# EAGLE design VauDUOv1_2 (EAGLE 6.5.0)
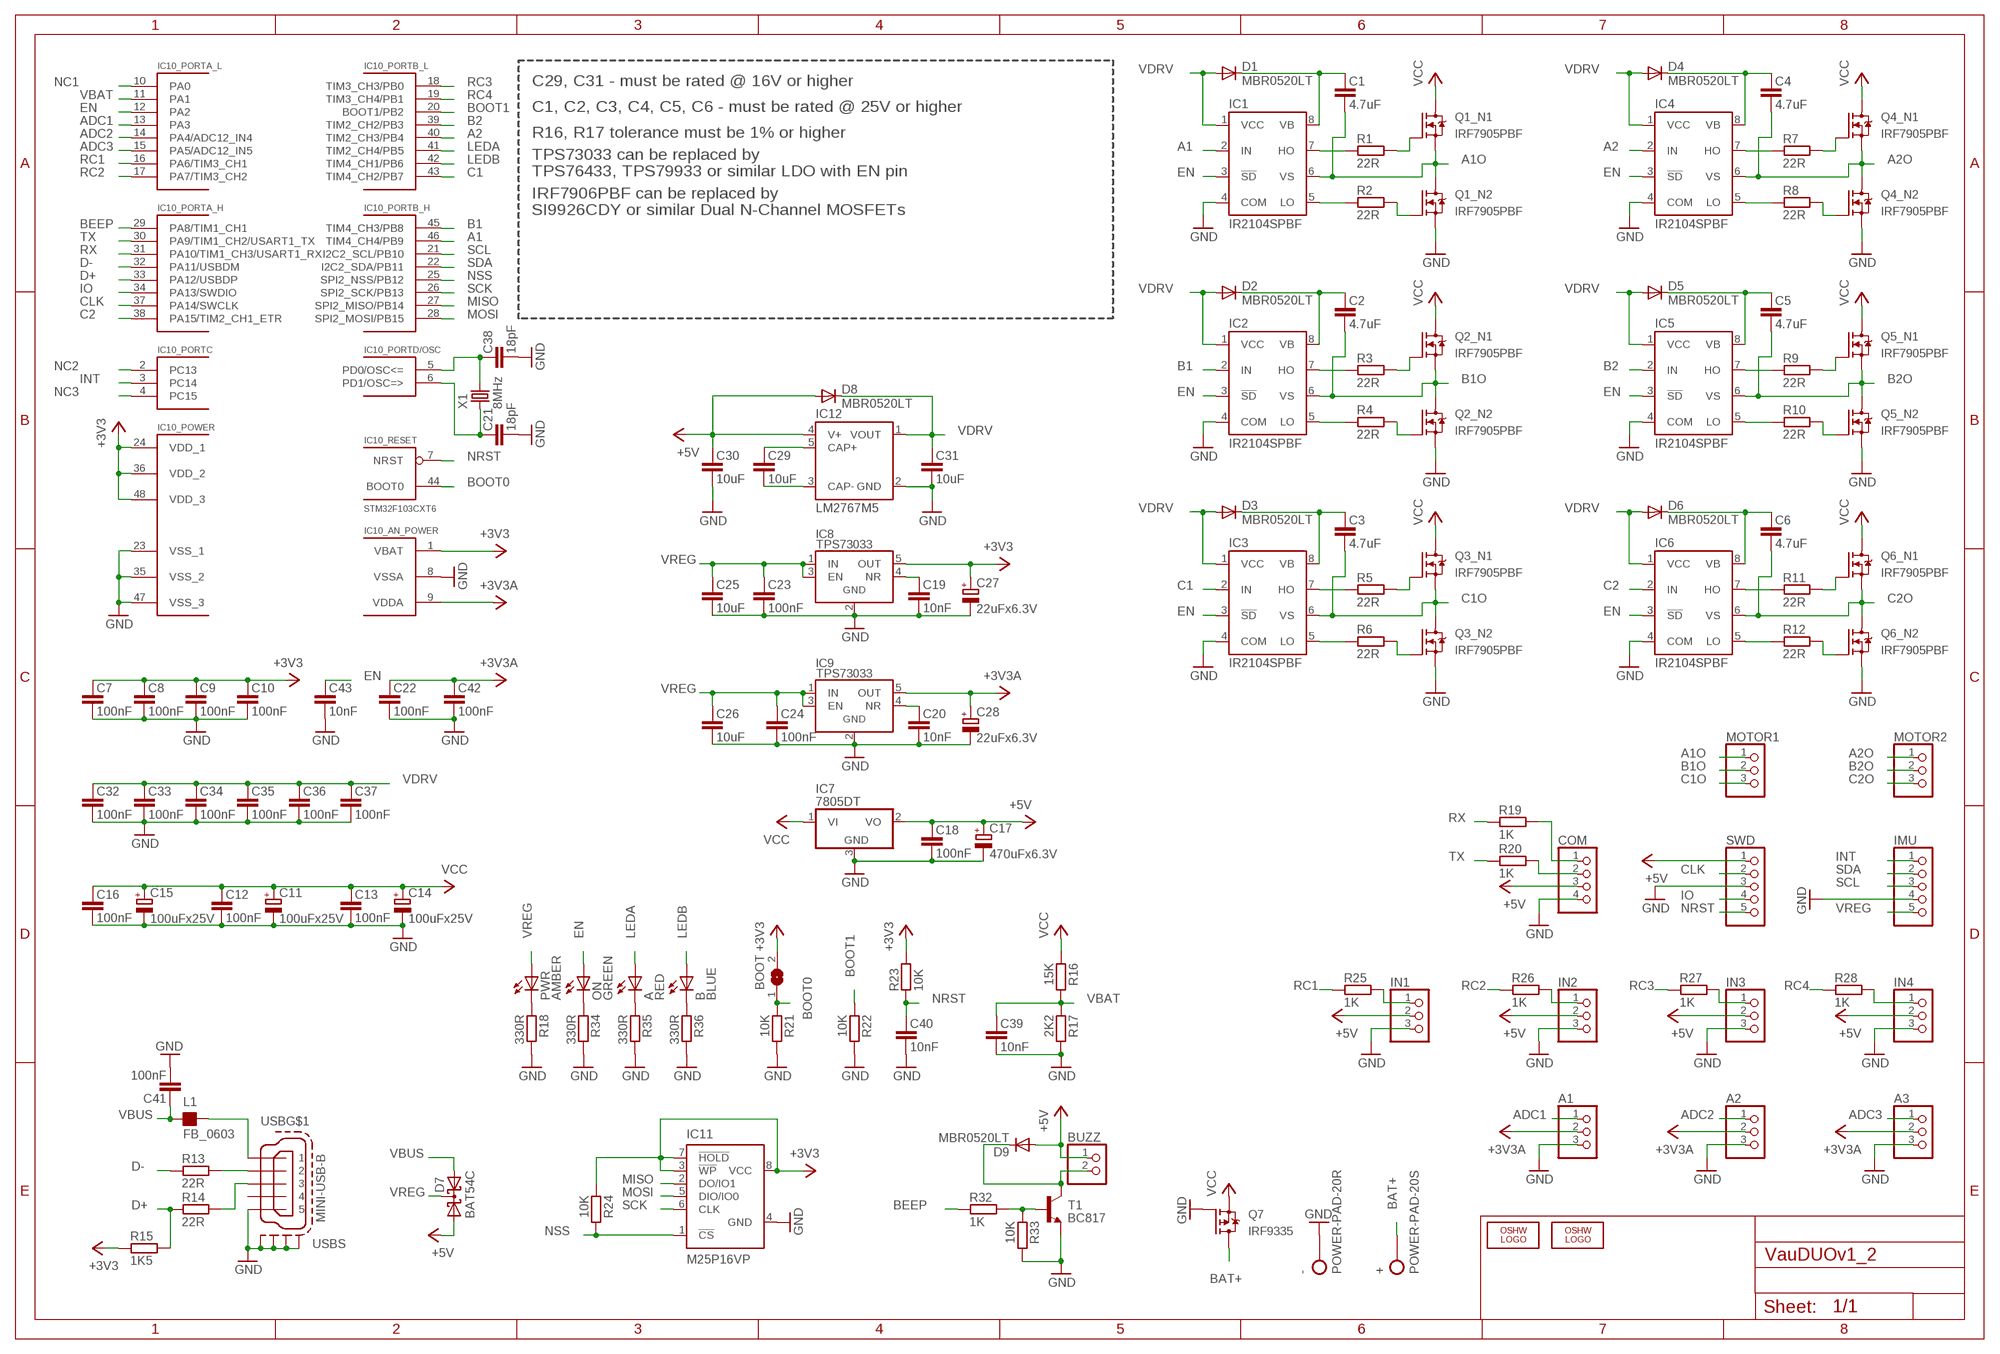
[diagram p0: schematic, sheet 1]

## Parts
+  POWER-PAD-20S  [PAD20S]
-  POWER-PAD-20R  [PAD20R]
A  RED  LEDCHIPLED_0805  [CHIPLED_0805]
A1  PINHD-1X3  [1X03]
A2  PINHD-1X3  [1X03]
A3  PINHD-1X3  [1X03]
B  BLUE  LEDCHIPLED_0805  [CHIPLED_0805]
BOOT  SJ  [SJ]
BUZZ  PINHD-1X2  [1X02]
C1  4.7uF  C_EU_C0805  [C0805]
C2  4.7uF  C_EU_C0805  [C0805]
C3  4.7uF  C_EU_C0805  [C0805]
C4  4.7uF  C_EU_C0805  [C0805]
C5  4.7uF  C_EU_C0805  [C0805]
C6  4.7uF  C_EU_C0805  [C0805]
C7  100nF  C_EU_C0603G  [C0603G]
C8  100nF  C_EU_C0603G  [C0603G]
C9  100nF  C_EU_C0603G  [C0603G]
C10  100nF  C_EU_C0603G  [C0603G]
C11  100uFx25V  CPOL-EUE2.5-7  [E2,5-7]
C12  100nF  C_EU_C0603G  [C0603G]
C13  100nF  C_EU_C0603G  [C0603G]
C14  100uFx25V  CPOL-EUE2.5-7  [E2,5-7]
C15  100uFx25V  CPOL-EUSMCD  [SMC_D]
C16  100nF  C_EU_C0603G  [C0603G]
C17  470uFx6.3V  CPOL-EUSMCD  [SMC_D]
C18  100nF  C_EU_C0603G  [C0603G]
C19  10nF  C_EU_C0603G  [C0603G]
C20  10nF  C_EU_C0603G  [C0603G]
C21  18pF  C_EU_C0603G  [C0603G]
C22  100nF  C_EU_C0603G  [C0603G]
C23  100nF  C_EU_C0603G  [C0603G]
C24  100nF  C_EU_C0603G  [C0603G]
C25  10uF  C_EU_C0805G  [C0805G]
C26  10uF  C_EU_C0805G  [C0805G]
C27  22uFx6.3V  CPOL-EUSMCA  [SMC_A]
C28  22uFx6.3V  CPOL-EUSMCA  [SMC_A]
C29  10uF  C_EU_C0805  [C0805]
C30  10uF  C_EU_C0805G  [C0805G]
C31  10uF  C_EU_C0805G  [C0805G]
C32  100nF  C_EU_C0603G  [C0603G]
C33  100nF  C_EU_C0603G  [C0603G]
C34  100nF  C_EU_C0603G  [C0603G]
C35  100nF  C_EU_C0603G  [C0603G]
C36  100nF  C_EU_C0603G  [C0603G]
C37  100nF  C_EU_C0603G  [C0603G]
C38  18pF  C_EU_C0603G  [C0603G]
C39  10nF  C_EU_C0603G  [C0603G]
C40  10nF  C_EU_C0603G  [C0603G]
C41  100nF  C_EU_C0603G  [C0603G]
C42  100nF  C_EU_C0603G  [C0603G]
C43  10nF  C_EU_C0603G  [C0603G]
COM  PINHD-1X4  [1X04]
D1  MBR0520LT  [SOD123]
D2  MBR0520LT  [SOD123]
D3  MBR0520LT  [SOD123]
D4  MBR0520LT  [SOD123]
D5  MBR0520LT  [SOD123]
D6  MBR0520LT  [SOD123]
D7  BAT54C  [SOT23]
D8  MBR0520LT  [SOD123]
D9  MBR0520LT  [SOD123]
IC1  IR2104SPBF  [SOIC-8]
IC2  IR2104SPBF  [SOIC-8]
IC3  IR2104SPBF  [SOIC-8]
IC4  IR2104SPBF  [SOIC-8]
IC5  IR2104SPBF  [SOIC-8]
IC6  IR2104SPBF  [SOIC-8]
IC7  7805DT  [TO252]
IC8  TPS73033  TPS769XX  [SOT23-5]
IC9  TPS73033  TPS769XX  [SOT23-5]
IC10  STM32F103CXT6  [LQFP48]
IC11  M25P16VP  W25X40BVSNIG  [SOIC-8]
IC12  LM2767M5  [SOT23-5]
IMU  PINHD-1X5  [1X05]
IN1  PINHD-1X3  [1X03]
IN2  PINHD-1X3  [1X03]
IN3  PINHD-1X3  [1X03]
IN4  PINHD-1X3  [1X03]
L1  FB_0603  [L0603]
LOGO1  OSHW_LOGO_10MILX0350-NT  [OSHW_10X350_NOTEXT]
LOGO2  OSHW_LOGO_FILLX0150-NT  [OSHW_FILLX150_NOTEXT]
MOTOR1  PINHD-1X3MOT  [1X03M]
MOTOR2  PINHD-1X3MOT  [1X03M]
ON  GREEN  LEDCHIPLED_0805  [CHIPLED_0805]
PWR  AMBER  LEDCHIPLED_0805  [CHIPLED_0805]
Q1  IRF7905PBF  [SOIC-8]
Q2  IRF7905PBF  [SOIC-8]
Q3  IRF7905PBF  [SOIC-8]
Q4  IRF7905PBF  [SOIC-8]
Q5  IRF7905PBF  [SOIC-8]
Q6  IRF7905PBF  [SOIC-8]
Q7  IRF9335  [SOIC-8]
R1  22R  R_EU_R0603  [R0603]
R2  22R  R_EU_R0603  [R0603]
R3  22R  R_EU_R0603  [R0603]
R4  22R  R_EU_R0603  [R0603]
R5  22R  R_EU_R0603  [R0603]
R6  22R  R_EU_R0603  [R0603]
R7  22R  R_EU_R0603  [R0603]
R8  22R  R_EU_R0603  [R0603]
R9  22R  R_EU_R0603  [R0603]
R10  22R  R_EU_R0603  [R0603]
R11  22R  R_EU_R0603  [R0603]
R12  22R  R_EU_R0603  [R0603]
R13  22R  R_EU_R0603  [R0603]
R14  22R  R_EU_R0603  [R0603]
R15  1K5  R_EU_R0603  [R0603]
R16  15K  R_EU_R0603  [R0603]
R17  2K2  R_EU_R0603G  [R0603G]
R18  330R  R_EU_R0603G  [R0603G]
R19  1K  R_EU_R0603  [R0603]
R20  1K  R_EU_R0603  [R0603]
R21  10K  R_EU_R0603G  [R0603G]
R22  10K  R_EU_R0603G  [R0603G]
R23  10K  R_EU_R0603  [R0603]
R24  10K  R_EU_R0603  [R0603]
R25  1K  R_EU_R0603  [R0603]
R26  1K  R_EU_R0603  [R0603]
R27  1K  R_EU_R0603  [R0603]
R28  1K  R_EU_R0603  [R0603]
R32  1K  R_EU_R0603  [R0603]
R33  10K  R_EU_R0603G  [R0603G]
R34  330R  R_EU_R0603G  [R0603G]
R35  330R  R_EU_R0603G  [R0603G]
R36  330R  R_EU_R0603G  [R0603G]
SWD  PINHD-1X5  [1X05]
T1  BC817  BC817-16LT1SMD  [SOT23-BEC]
USB  MINI-USB-B  MINI-USB-SCHIELD-32005-201  [32005-201]
X1  8MHz  CRYSTALHC49S  [HC49/S]

## Nets
+3V3: BOOT.2 C7.1 C8.1 C9.1 C10.1 C27.+ IC8.5(OUT) IC10.1(_AN_POWER:VBAT) IC10.24(_POWER:VDD_1) IC10.36(_POWER:VDD_2) IC10.48(_POWER:VDD_3) IC11.3(!WP) IC11.7(!HOLD) IC11.8(VCC) R15.1 R23.2 R24.1
+3V3A: A1.2 A2.2 A3.2 C22.1 C28.+ C42.1 IC9.5(OUT) IC10.9(_AN_POWER:VDDA)
+5V: BUZZ.1 C17.+ C18.1 C30.1 COM.3 D7.1(A1) D8.A D9.A IC7.2(VO) IC12.4(V+) IN1.2 IN2.2 IN3.2 IN4.2 SWD.1
A1: IC1.2(IN) IC10.46(_PORTB_H:TIM4_CH4/PB9)
A1O [power]: C1.2 IC1.6(VS) MOTOR1.1 Q1.3(_N1:N-S) Q1.7(_N2:N-D) Q1.8(_N2:N-D)
A2: IC4.2(IN) IC10.40(_PORTB_L:TIM2_CH3/PB4)
A2O [power]: C4.2 IC4.6(VS) MOTOR2.1 Q4.3(_N1:N-S) Q4.7(_N2:N-D) Q4.8(_N2:N-D)
ADC1: A1.1 IC10.13(_PORTA_L:PA3)
ADC2: A2.1 IC10.14(_PORTA_L:PA4/ADC12_IN4)
ADC3: A3.1 IC10.15(_PORTA_L:PA5/ADC12_IN5)
B1: IC2.2(IN) IC10.45(_PORTB_H:TIM4_CH3/PB8)
B1O [power]: C2.2 IC2.6(VS) MOTOR1.2 Q2.3(_N1:N-S) Q2.7(_N2:N-D) Q2.8(_N2:N-D)
B2: IC5.2(IN) IC10.39(_PORTB_L:TIM2_CH2/PB3)
B2O [power]: C5.2 IC5.6(VS) MOTOR2.2 Q5.3(_N1:N-S) Q5.7(_N2:N-D) Q5.8(_N2:N-D)
BAT+ [power]: +.P$1 Q7.5(P-D) Q7.6(P-D) Q7.7(P-D) Q7.8(P-D)
BEEP: IC10.29(_PORTA_H:PA8/TIM1_CH1) R32.1
BOOT0: BOOT.1 IC10.44(_RESET:BOOT0) R21.1
BOOT1: IC10.20(_PORTB_L:BOOT1/PB2) R22.1
C1: IC3.2(IN) IC10.43(_PORTB_L:TIM4_CH2/PB7)
C1O [power]: C3.2 IC3.6(VS) MOTOR1.3 Q3.3(_N1:N-S) Q3.7(_N2:N-D) Q3.8(_N2:N-D)
C2: IC6.2(IN) IC10.38(_PORTA_H:PA15/TIM2_CH1_ETR)
C2O [power]: C6.2 IC6.6(VS) MOTOR2.3 Q6.3(_N1:N-S) Q6.7(_N2:N-D) Q6.8(_N2:N-D)
CLK: IC10.37(_PORTA_H:PA14/SWCLK) SWD.2
D+: IC10.33(_PORTA_H:PA12/USBDP) R14.1 R15.2
D-: IC10.32(_PORTA_H:PA11/USBDM) R13.1
EN: C43.1 IC1.3(!SD) IC2.3(!SD) IC3.3(!SD) IC4.3(!SD) IC5.3(!SD) IC6.3(!SD) IC10.12(_PORTA_L:PA2) ON.A
GND: -.P$1 A1.3 A2.3 A3.3 C7.2 C8.2 C9.2 C10.2 C11.- C12.2 C13.2 C14.- C15.- C16.2 C17.- C18.2 C19.2 C20.2 C21.2 C22.2 C23.2 C24.2 C25.2 C26.2 C27.- C28.- C30.2 C31.2 C32.2 C33.2 C34.2 C35.2 C36.2 C37.2 C38.2 C39.2 C40.2 C41.2 C42.2 C43.2 COM.4 IC1.4(COM) IC2.4(COM) IC3.4(COM) IC4.4(COM) IC5.4(COM) IC6.4(COM) IC7.3(GND) IC8.2(GND) IC9.2(GND) IC10.8(_AN_POWER:VSSA) IC10.23(_POWER:VSS_1) IC10.35(_POWER:VSS_2) IC10.47(_POWER:VSS_3) IC11.4(GND) IC12.2(GND) IMU.4 IN1.3 IN2.3 IN3.3 IN4.3 Q1.1(_N2:N-S) Q2.1(_N2:N-S) Q3.1(_N2:N-S) Q4.1(_N2:N-S) Q5.1(_N2:N-S) Q6.1(_N2:N-S) Q7.4(P-G) R17.2 R18.2 R21.2 R22.2 R33.2 R34.2 R35.2 R36.2 SWD.3 T1.E USB.5 USB.M1(S:S1) USB.M2(S:S2) USB.M3(S:S3) USB.M4(S:S4)
INT: IC10.3(_PORTC:PC14) IMU.1
IO: IC10.34(_PORTA_H:PA13/SWDIO) SWD.4
LEDA: A.A IC10.41(_PORTB_L:TIM2_CH4/PB5)
LEDB: B.A IC10.42(_PORTB_L:TIM4_CH1/PB6)
MISO: IC10.27(_PORTB_H:SPI2_MISO/PB14) IC11.2(DO/IO1)
MOSI: IC10.28(_PORTB_H:SPI2_MOSI/PB15) IC11.5(DIO/IO0)
N$1: IC2.7(HO) R3.1
N$2: Q1.2(_N2:N-G) R2.2
N$3: Q1.4(_N1:N-G) R1.2
N$4: IC2.5(LO) R4.1
N$5 [power]: C2.1 D2.C IC2.8(VB)
N$6 [power]: C1.1 D1.C IC1.8(VB)
N$7: Q2.2(_N2:N-G) R4.2
N$8: Q2.4(_N1:N-G) R3.2
N$9: IC3.7(HO) R5.1
N$10: IC3.5(LO) R6.1
N$11 [power]: C3.1 D3.C IC3.8(VB)
N$12: Q3.2(_N2:N-G) R6.2
N$13: Q3.4(_N1:N-G) R5.2
N$14: IC4.7(HO) R7.1
N$15: IC4.5(LO) R8.1
N$16 [power]: C4.1 D4.C IC4.8(VB)
N$17: Q4.2(_N2:N-G) R8.2
N$18: Q4.4(_N1:N-G) R7.2
N$19: IC1.7(HO) R1.1
N$20: IC1.5(LO) R2.1
N$21: IC5.7(HO) R9.1
N$22: IC5.5(LO) R10.1
N$23 [power]: C5.1 D5.C IC5.8(VB)
N$24: Q5.2(_N2:N-G) R10.2
N$25: Q5.4(_N1:N-G) R9.2
N$26: IC6.7(HO) R11.1
N$27: IC6.5(LO) R12.1
N$28 [power]: C6.1 D6.C IC6.8(VB)
N$29: Q6.2(_N2:N-G) R12.2
N$30: Q6.4(_N1:N-G) R11.2
N$31: R13.2 USB.2
N$32: C29.1 IC12.5(CAP+)
N$33: R14.2 USB.3
N$34: C19.1 IC8.4(NR)
N$35: IN1.1 R25.2
N$36: C20.1 IC9.4(NR)
N$37: L1.2 USB.1
N$38: C21.1 IC10.6(_PORTD/OSC:PD1/OSC=>) X1.1
N$39: C38.1 IC10.5(_PORTD/OSC:PD0/OSC<=) X1.2
N$40: C29.2 IC12.3(CAP-)
N$41: PWR.C R18.1
N$42: COM.1 R19.2
N$43: COM.2 R20.2
N$44: IN2.1 R26.2
N$45: IN3.1 R27.2
N$46: IN4.1 R28.2
N$49: BUZZ.2 D9.C T1.C
N$50: R32.2 R33.1 T1.B
N$51: ON.C R34.1
N$55: A.C R35.1
N$56: B.C R36.1
NC1: IC10.10(_PORTA_L:PA0)
NC2: IC10.2(_PORTC:PC13)
NC3: IC10.4(_PORTC:PC15)
NRST: C40.1 IC10.7(_RESET:NRST) R23.1 SWD.5
NSS: IC10.25(_PORTB_H:SPI2_NSS/PB12) IC11.1(!CS) R24.2
RC1: IC10.16(_PORTA_L:PA6/TIM3_CH1) R25.1
RC2: IC10.17(_PORTA_L:PA7/TIM3_CH2) R26.1
RC3: IC10.18(_PORTB_L:TIM3_CH3/PB0) R27.1
RC4: IC10.19(_PORTB_L:TIM3_CH4/PB1) R28.1
RX: IC10.31(_PORTA_H:PA10/TIM1_CH3/USART1_RX) R19.1
SCK: IC10.26(_PORTB_H:SPI2_SCK/PB13) IC11.6(CLK)
SCL: IC10.21(_PORTB_H:I2C2_SCL/PB10) IMU.3
SDA: IC10.22(_PORTB_H:I2C2_SDA/PB11) IMU.2
TX: IC10.30(_PORTA_H:PA9/TIM1_CH2/USART1_TX) R20.1
VBAT: C39.1 IC10.11(_PORTA_L:PA1) R16.2 R17.1
VBUS: C41.1 D7.2(A2) L1.1
VCC [power]: C11.+ C12.1 C13.1 C14.+ C15.+ C16.1 IC7.1(VI) Q1.5(_N1:N-D) Q1.6(_N1:N-D) Q2.5(_N1:N-D) Q2.6(_N1:N-D) Q3.5(_N1:N-D) Q3.6(_N1:N-D) Q4.5(_N1:N-D) Q4.6(_N1:N-D) Q5.5(_N1:N-D) Q5.6(_N1:N-D) Q6.5(_N1:N-D) Q6.6(_N1:N-D) Q7.1(P-S) Q7.2(P-S) Q7.3(P-S) R16.1
VDRV: C31.1 C32.1 C33.1 C34.1 C35.1 C36.1 C37.1 D1.A D2.A D3.A D4.A D5.A D6.A D8.C IC1.1(VCC) IC2.1(VCC) IC3.1(VCC) IC4.1(VCC) IC5.1(VCC) IC6.1(VCC) IC12.1(VOUT)
VREG: C23.1 C24.1 C25.1 C26.1 D7.3(CC) IC8.1(IN) IC8.3(EN) IC9.1(IN) IC9.3(EN) IMU.5 PWR.A
Unconnected: USB.4

## Notes on the sheet
- C29, C31 - must be rated @ 16V or higher
- C1, C2, C3, C4, C5, C6 - must be rated @ 25V or higher
- R16, R17 tolerance must be 1% or higher
- TPS73033 can be replaced by
  TPS76433, TPS79933 or similar LDO with EN pin
- IRF7906PBF can be replaced by
  SI9926CDY or similar Dual N-Channel MOSFETs

## Library data of the parts
+ - = svBGC:POWER-PAD
A B ON PWR = svBGC:LED
A1-A3 IN1-IN4 MOTOR1 MOTOR2 = svBGC:PINHD-1X3: PIN HEADER
BOOT = svBGC:SJ: SMD solder JUMPER
BUZZ = svBGC:PINHD-1X2: PIN HEADER
C1-C10 C12 C13 C16 C18-C26 C29-C43 = svBGC:C_EU_
C11 C14 C15 C17 C27 C28 = svBGC:CPOL-EU: POLARIZED CAPACITOR, European symbol
COM = svBGC:PINHD-1X4: PIN HEADER
D1-D6 D8 D9 = svBGC:MBR0520LT: SCHOTTKY BARRIER RECTIFIER Source: http://onsemi.com .. MBR0520LT1-D.pdf
D7 = svBGC:BAT54C: Schottky Diodes Source: Fairchild .. BAT54.pdf
IC1-IC6 = svBGC:IR2104: International Rectifier IR2104(S) & (PbF) HALF-BRIDGE DRIVER Product Summary VOFFSET 600V max. IO+/- 130 mA / 270 mA VOUT 10 - 20V ton/off (typ.) 680 & 150 ns Deadtime (typ.) 520 ns
IC7 = linear:78*: Positive VOLTAGE REGULATOR Source: http://cache.national.com/ds/LM/LM78L05.pdf http://www.fairchildsemi.com/ds/LM/LM7805.pdf
IC8 IC9 = svBGC:TPS769XX: Texas Instruments LDO Regulator
IC10 = svBGC:STM32F103CXT6
IC11 = svBGC:W25X: Winbond SPI Flash Memory
IC12 = svBGC:LM2767: Texas Instruments LM2767 Switched Capacitor Voltage Converter FEATURES Doubles Input Supply Voltage SOT-23 5-Pin Package 20Ω Typical Output Impedance 96% Typical Conversion Efficiency at 15mA
IMU SWD = svBGC:PINHD-1X5: PIN HEADER
L1 = svBGC:FB_: FERRITE BEAD
LOGO1 = ohw-logo:OSHW_LOGO_10MIL
LOGO2 = ohw-logo:OSHW_LOGO_FILL
Q1-Q6 = svBGC:IRF7905
Q7 = svBGC:IRF9335
R1-R28 R32-R36 = svBGC:R_EU_
T1 = svBGC:BC817*: NPN Transistor
USB = svBGC:MINI-USB-SCHIELD-: MINI USB-B Conector Source: www.cypressindustries.com; OC_FARNELL: unknown; OC_NEWARK: unknown
X1 = svBGC:CRYSTAL: CRYSTAL; OC_FARNELL: 1667008; OC_NEWARK: unknown

## Net classes
0 default: width 0.203 mm, clearance 0.203 mm
1 power: width 0.254 mm, clearance 0.305 mm

## Board
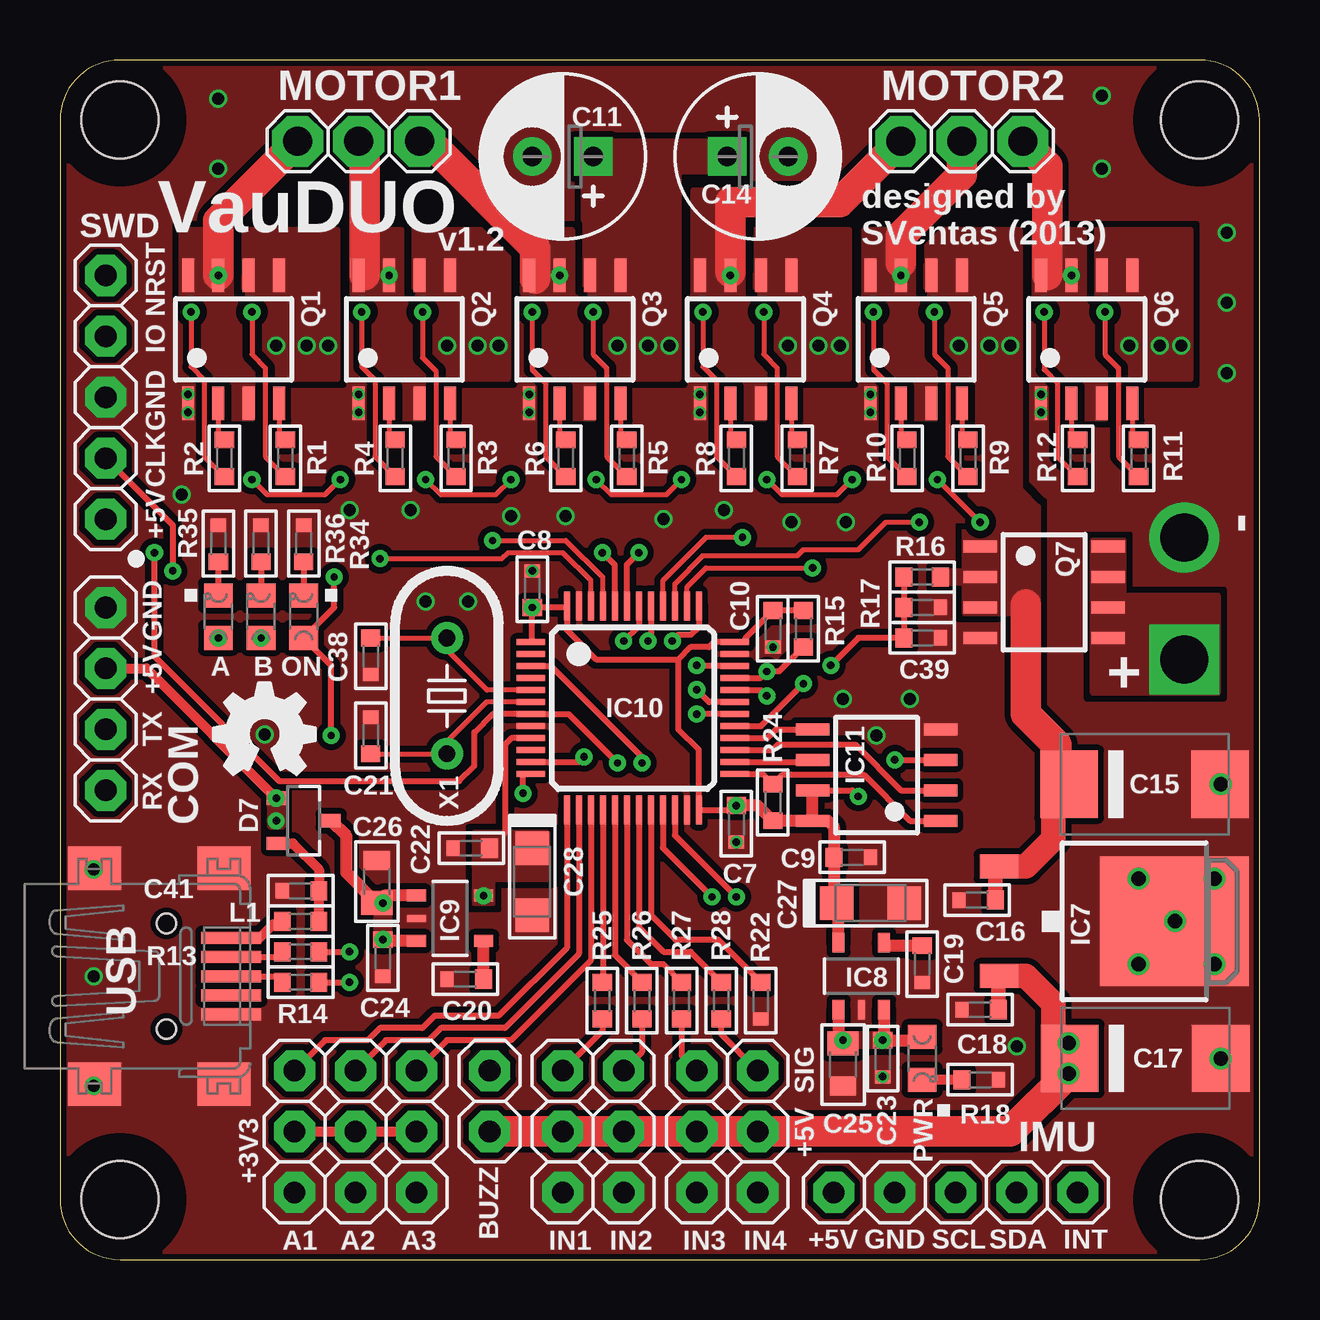
[diagram p1: board, top side]
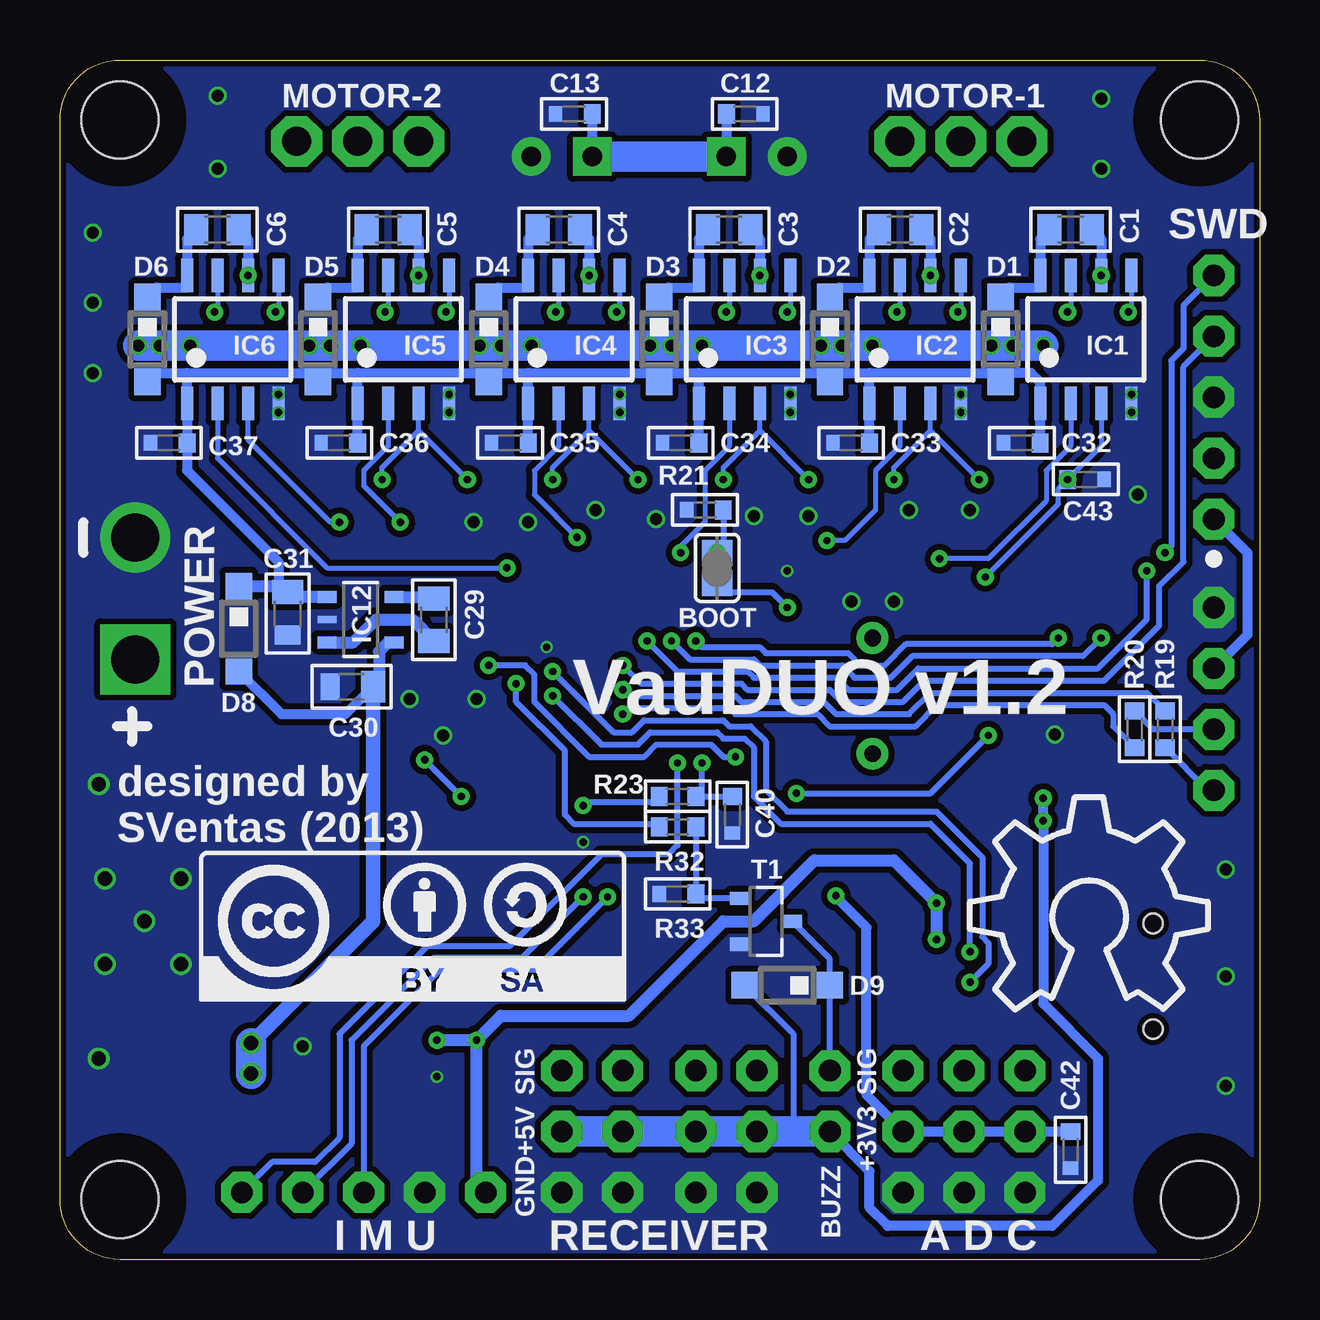
[diagram p2: board, bottom side, seen from below]

Size 50 x 50 mm. Coordinates in mm from the lower left corner, seen from the top.
Outline: 2.5,0 47.5,0 arc90 50,2.5 50,47.5 arc90 47.5,50 2.5,50 arc90 0,47.5 0,2.5 arc90 2.5,0
Copper layers (1*16): Top 0.035mm / dielectric 1.5mm / Bottom 0.035mm
Design rules "default *": minimum track width 8mil, minimum drill 12mil, track to track 8mil, track to pad 8mil, pad to pad 8mil, via to via 8mil, smd to smd 0mil, copper to edge 10mil, drill to drill 12mil, minimum pad ring 10mil, minimum via ring 4mil, stop-mask expansion 4mil, vias tented up to drill 20mil, thermal gap 10mil
Holes 3.2 mm at 2.5,47.5 47.5,47.5 2.5,2.5 47.5,2.5
tRestrict: area 0,0 to 5,5; area 45,0 to 50,5; area 45,45 to 50,50; area 0,45 to 5,50
bRestrict: area 0,45 to 5,50; area 45,45 to 50,50; area 0,0 to 5,5; area 45,0 to 50,5

### Footprints (pad centres in the part's own frame; a part is rotated, then mirrored left to right if it is on the bottom)
PAD20S = drill 2 square: P$1 0,0
PAD20R = drill 2: P$1 0,0
CHIPLED_0805 = smd 1.2 x 1: A 0,-0.889; C 0,0.889
1X03 = drill 0.9 octagon: 1 -2.54,0; 2 0,0; 3 2.54,0
SJ = smd 1.067 x 1.27: 1 -0.635,0; 2 0.635,0
1X02 = drill 0.9 octagon: 1 -1.27,0; 2 1.27,0
C0805 = smd 1 x 1.3: 1 -0.889,0; 2 0.889,0
C0603G = smd 0.7 x 0.8: 1 -0.762,0 | smd 0.548 x 0.648: 2 0.762,0
E2,5-7 = drill 0.813 pad 1.6 square: + -1.27,0 | drill 0.813 pad 1.6: - 1.27,0
SMC_D = smd 2.4 x 2.8: + -3.15,0; - 3.15,0
C0805G = smd 1 x 1.3: 1 -0.889,0 | smd 0.797 x 1.097: 2 0.889,0
SMC_A = smd 1.4 x 1.4: + -1.4,0; - 1.4,0
1X04 = drill 0.9 octagon: 1 -3.81,0; 2 -1.27,0; 3 1.27,0; 4 3.81,0
SOD123 = smd 1.1 x 1.1: A 1.778,0; C -1.778,0
SOT23 = smd 0.55 x 0.8: 1 -0.94,-1.143; 2 0.94,-1.143; 3 0,1.143
SOIC-8 = smd 0.5 x 1.4: 1 -1.905,-2.667; 2 -0.635,-2.667; 3 0.635,-2.667; 4 1.905,-2.667; 5 1.905,2.667; 6 0.635,2.667; 7 -0.635,2.667; 8 -1.905,2.667
TO252 = smd 1 x 1.6: 1 -2.28,-4.8; 2 2.28,-4.8 | smd 5.4 x 6.2: 3 0,2.5
SOT23-5 = smd 0.5 x 0.8: 1 -0.95,-1.397; 3 0.95,-1.397; 4 0.95,1.397; 5 -0.95,1.397 | smd 0.297 x 0.8: 2 0,-1.397
LQFP48 = smd 0.25 x 1.2: 1 -2.75,-4.25; 2 -2.25,-4.25; 3 -1.75,-4.25; 4 -1.25,-4.25; 5 -0.75,-4.25; 6 -0.25,-4.25; 7 0.25,-4.25; 8 0.75,-4.25; 9 1.25,-4.25; 10 1.75,-4.25; 11 2.25,-4.25; 12 2.75,-4.25; 25 2.75,4.25; 26 2.25,4.25; 27 1.75,4.25; 28 1.25,4.25; 29 0.75,4.25; 30 0.25,4.25; 31 -0.25,4.25; 32 -0.75,4.25; 33 -1.25,4.25; 34 -1.75,4.25; 35 -2.25,4.25; 36 -2.75,4.25 | smd 1.2 x 0.25: 13 4.25,-2.75; 14 4.25,-2.25; 15 4.25,-1.75; 16 4.25,-1.25; 17 4.25,-0.75; 18 4.25,-0.25; 19 4.25,0.25; 20 4.25,0.75; 21 4.25,1.25; 22 4.25,1.75; 23 4.25,2.25; 24 4.25,2.75; 37 -4.25,2.75; 38 -4.25,2.25; 39 -4.25,1.75; 40 -4.25,1.25; 41 -4.25,0.75; 42 -4.25,0.25; 43 -4.25,-0.25; 44 -4.25,-0.75; 45 -4.25,-1.25; 46 -4.25,-1.75; 47 -4.25,-2.25; 48 -4.25,-2.75
1X05 = drill 0.9 octagon: 1 -5.08,0; 2 -2.54,0; 3 0,0; 4 2.54,0; 5 5.08,0
L0603 = smd 0.7 x 0.8: 1 -0.762,0; 2 0.762,0
1X03M = drill 1.2 octagon: 1 -2.54,0; 2 0,0; 3 2.54,0
R0603 = smd 0.7 x 0.8: 1 -0.762,0; 2 0.762,0
R0603G = smd 0.7 x 0.8: 1 -0.762,0 | smd 0.548 x 0.648: 2 0.762,0
SOT23-BEC = smd 0.55 x 0.8: B -0.95,-1.1; C 0,1.1; E 0.95,-1.1
32005-201 = smd 2.5 x 0.5: 1 2.7,1.6; 2 2.7,0.8; 3 2.7,0; 4 2.7,-0.8; 5 2.7,-1.6 | smd 2.2 x 1.8: M1 -3,-4.5; M2 -3,4.5; M3 2.4,4.5; M4 2.4,-4.5 | hole 0.8: 0,2.2; 0,-2.2
HC49/S = drill 0.7: 1 -2.413,0; 2 2.413,0

### Placement (x,y rotation side)
+  46.86,25.02 0 top
-  46.86,30.1 0 top
A  6.6,26.8 0 top
A1  9.78,5.33 270 top
A2  12.32,5.33 270 top
A3  14.86,5.33 270 top
B  8.38,26.8 0 top
BOOT  22.61,28.83 270 bottom
BUZZ  17.91,6.6 90 top
C1  7.87,42.93 0 bottom
C2  14.99,42.93 0 bottom
C3  22.1,42.93 0 bottom
C4  29.21,42.93 0 bottom
C5  36.32,42.93 0 bottom
C6  43.43,42.93 0 bottom
C7  28.19,18.16 270 top
C8  19.68,27.94 90 top
C9  33.02,16.76 0 top
C10  29.72,26.29 270 top
C11  20.95,45.97 180 top
C12  21.46,47.75 0 bottom
C13  28.57,47.75 180 bottom
C14  29.08,45.97 0 top
C15  45.21,19.81 0 top
C16  38.23,14.99 180 top
C17  45.24,8.38 0 top
C18  38.35,10.41 180 top
C19  35.94,12.32 270 top
C20  16.89,11.68 180 top
C21  12.95,21.84 90 top
C22  17.14,17.14 180 top
C23  34.29,8.38 270 top
C24  13.46,12.57 270 top
C25  32.64,8.13 270 top
C26  13.21,15.75 90 top
C27  33.78,14.86 0 top
C28  19.68,15.75 270 top
C29  34.42,26.67 270 bottom
C30  37.85,23.88 180 bottom
C31  40.51,26.92 270 bottom
C32  9.91,34.04 180 bottom
C33  17.02,34.04 180 bottom
C34  24.13,34.04 180 bottom
C35  31.24,34.04 180 bottom
C36  38.35,34.04 180 bottom
C37  45.47,34.04 180 bottom
C38  12.95,25.15 270 top
C39  35.94,25.91 0 top
C40  21.97,18.54 270 bottom
C41  10.03,15.37 180 top
C42  7.87,4.57 270 bottom
C43  7.24,32.51 0 bottom
COM  1.91,23.37 90 top
D1  10.79,38.35 270 bottom
D2  17.91,38.35 270 bottom
D3  25.02,38.35 270 bottom
D4  32.13,38.35 270 bottom
D5  39.24,38.35 270 bottom
D6  46.35,38.35 270 bottom
D7  10.16,18.29 270 top
D8  42.55,26.29 270 bottom
D9  19.68,11.43 180 bottom
IC1  7.24,38.35 0 bottom
IC2  14.35,38.35 0 bottom
IC3  21.46,38.35 0 bottom
IC4  28.57,38.35 0 bottom
IC5  35.69,38.35 0 bottom
IC6  42.8,38.35 0 bottom
IC7  43.94,14.1 270 top
IC8  33.4,11.81 0 top
IC9  16.26,14.22 270 top
IC10  23.88,22.99 270 top
IC11  34.04,20.19 90 top
IC12  37.47,26.67 270 bottom
IMU  37.34,2.79 180 top
IN1  20.95,5.33 270 top
IN2  23.5,5.33 270 top
IN3  26.54,5.33 270 top
IN4  29.08,5.33 270 top
L1  10.03,14.1 180 top
LOGO1  12.06,10.41 0 bottom
LOGO2  6.4,20.22 0 top
MOTOR1  12.45,46.61 0 top
MOTOR2  37.59,46.61 0 top
ON  10.16,26.8 0 top
PWR  35.94,8.38 180 top
Q1  7.24,38.35 0 top
Q2  14.35,38.35 0 top
Q3  21.46,38.35 0 top
Q4  28.57,38.35 0 top
Q5  35.69,38.35 0 top
Q6  42.8,38.35 0 top
Q7  41.02,27.81 270 top
R1  9.4,33.4 90 top
R2  6.86,33.4 90 top
R3  16.51,33.4 90 top
R4  13.97,33.4 90 top
R5  23.62,33.4 90 top
R6  21.08,33.4 90 top
R7  30.73,33.4 90 top
R8  28.19,33.4 90 top
R9  37.85,33.4 90 top
R10  35.31,33.4 90 top
R11  44.96,33.4 90 top
R12  42.42,33.4 90 top
R13  10.03,12.83 180 top
R14  10.03,11.56 180 top
R15  30.99,26.29 270 top
R16  35.94,28.45 180 top
R17  35.94,27.18 0 top
R18  38.35,7.49 0 top
R19  3.94,22.1 270 bottom
R20  5.21,22.1 90 bottom
R21  23.11,31.24 180 bottom
R22  29.21,10.79 270 top
R23  24.26,19.3 180 bottom
R24  29.72,19.05 90 top
R25  22.61,10.79 270 top
R26  24.26,10.79 270 top
R27  25.91,10.79 270 top
R28  27.56,10.79 270 top
R32  24.26,18.03 0 bottom
R33  24.26,15.24 180 bottom
R34  10.16,29.84 90 top
R35  6.6,29.84 90 top
R36  8.38,29.84 90 top
SWD  1.91,35.94 90 top
T1  20.57,14.1 270 bottom
USB  4.45,11.81 0 top
X1  16.13,23.5 90 top

### Tracks (layer width: path | path; a pad name or v marks a point on that pad's centre or on a via)
+3V3  (via drill 0.3 pad 0.71)
  Top 0.254: R15.1 C10.1 28.57,25.91 28.57,25.78 28.53,25.74 IC10.36 27.26,25.74 27.05,25.53 26.29,25.53 25.78,25.02 | 21.13,27.18 21.13,26.25 22.35,25.02 25.78,25.02 | IC10.1 19.68,25.74 C8.1 21.13,27.18 | 25.78,25.02 25.78,22.1 26.63,21.25 IC10.24 28.01,18.74 C7.1 | IC10.48 21.13,27.18 | IC11.7 33.02,19.56 v33.27,19.3 | v34.8,20.83 IC11.3
  Top 0.406: IC11.8 32,18.29
  Top 0.508: IC11.7 IC11.8 R24.1 29.08,18.92 C7.1 | 32,18.29 32.26,18.03 C9.1 32.26,14.98 C27.+ 32.45,14.79 IC8.5
  Bottom 0.254: R23.2 25.02,19.05 28.07,19.05 C7.1 | BOOT.2 22.23,27.81 20.32,27.81 C8.1 | v33.27,19.3 v34.8,20.83
  other vias: 28.19,18.92 19.68,27.18
+3V3A  (via drill 0.3 pad 0.71)
  Top 0.254: IC10.9 18.82,21.74 18.54,21.46 18.54,17.78
  Top 0.406: IC9.5 v17.65,15.16 | A1.2 A2.2 A3.2
  Bottom 0.406: v17.65,15.16 17.65,15.11 16.38,13.84 16.38,6.86 A3.2 A2.2 A1.2 C42.1
  pour Top (no thermals): 17.27,14.86 18.03,14.86 18.03,15.88 20.32,15.88 20.32,17.78 17.27,17.78
+5V  (via drill 0.3 pad 0.71, 0.6)
  Top 0.406: COM.3 3.61,24.64 D7.1
  Top 0.61: IC7.2 39.12,11.78 C18.1
  Top 1.016: IC7.2 40.25,11.82 41.4,10.67 41.4,9.07 C17.+
  Top 1.27: v42.04,9.02 42.04,8.43 C17.+ | BUZZ.1 IN1.2 IN2.2 IN3.2 IN4.2 39.62,5.33 v42.04,7.75
  Bottom 0.254: D9.A 19.43,9.4 19.43,5.33
  Bottom 0.406: D7.1 v9.02,18.29 9.02,10.67 6.73,8.38 6.73,3.3 8.64,1.4 15.49,1.4 16.26,2.16 16.26,3.68 BUZZ.1 | SWD.1 0.51,29.46 0.51,26.04 COM.3 | D8.A 40.77,22.73 38.1,22.73 C30.1
  Bottom 0.508: C30.1 36.96,24.13 36.7,24.38 36.7,25.34 36.32,25.72 IC12.4
  Bottom 0.61: v42.04,9.02 36.96,14.1 C30.1
  Bottom 1.27: BUZZ.1 19.43,5.33 IN1.2 IN2.2 IN3.2 IN4.2 | v42.04,7.75 v42.04,9.02
  other vias: 9.02,19.23
  pour Top (no thermals): 8.76,19.43 9.27,19.43 9.27,18.03 8.76,18.03
A1  (via drill 0.3 pad 0.71)
  Top 0.203: IC10.46 22.13,28.29 20.95,29.46 18.67,29.46 18.41,29.21 v13.34,29.21
  Bottom 0.203: IC1.2 7.87,33.91 8.89,32.89 8.89,31.62 11.3,29.21 v13.34,29.21
A1O  (via drill 0.3 pad 0.71)
  Top 1.27: MOTOR1.1 6.6,43.31 IC1.6
  Bottom 0.406: C1.2 6.6,42.55 IC1.6
  other vias: 6.6,41.02
  pour Top (no thermals): 5.08,42.93 7.11,42.93 7.11,40.13 8,39.24 8,35.05 6.48,35.05 6.48,36.2 5.46,37.21 5.46,39.75 5.08,40.13
A2  (via drill 0.3 pad 0.71)
  Top 0.203: v28.45,30.1 26.92,30.1 25.13,28.3 IC10.40
  Bottom 0.203: IC4.2 29.21,33.91 30.23,32.89 30.23,31.88 v28.45,30.1
A2O  (via drill 0.3 pad 0.71)
  Top 1.27: MOTOR2.1 32.51,44.07 27.94,44.07 27.94,41.15
  Bottom 0.406: C4.2 27.94,42.55 IC4.6
  other vias: 27.94,41.02
  pour Top (no thermals): 26.42,44.58 28.45,44.58 28.45,40.13 29.34,39.37 29.34,35.05 27.81,35.05 27.81,36.45 26.8,37.47 26.8,39.5 26.42,39.88
ADC1
  Top 0.254: IC10.13 21.13,13 18.29,10.16 15.62,10.16 15.11,9.65 13.34,9.65 12.83,9.14 11.05,9.14 A1.1
ADC2
  Top 0.254: IC10.14 21.63,12.74 18.54,9.65 15.88,9.65 15.37,9.14 13.59,9.14 A2.1
ADC3
  Top 0.254: IC10.15 22.13,12.47 18.8,9.14 16.13,9.14 A3.1
B1  (via drill 0.3 pad 0.71)
  Top 0.203: v18.03,29.97 21.08,29.97 22.63,28.43 IC10.45
  Bottom 0.203: IC2.2 14.99,33.91 16,32.89 16,31.24 17.27,29.97 v18.03,29.97
B1O  (via drill 0.3 pad 0.71)
  Top 1.27: MOTOR1.2 12.7,46.35 12.7,41.02
  Bottom 0.406: C2.2 13.72,42.55 IC2.6
  other vias: 13.72,41.02
  pour Top (no thermals): 12.19,42.93 14.22,42.93 14.22,40.13 15.11,39.24 15.11,35.05 13.59,35.05 13.59,36.2 12.57,37.21 12.57,39.88 12.19,40.26
B2  (via drill 0.3 pad 0.71)
  Top 0.203: IC10.39 25.63,28.17 26.8,29.34 30.73,29.34 30.99,29.59 33.27,29.59 34.42,30.73 v35.81,30.73
  Bottom 0.203: IC5.2 36.32,33.91 37.34,32.89 37.34,32.26 v35.81,30.73
B2O  (via drill 0.3 pad 0.71)
  Top 1.27: MOTOR2.2 37.59,45.21 35.05,42.67 35.05,41.53
  Bottom 0.406: C5.2 35.05,42.55 IC5.6
  other vias: 35.05,41.02
  pour Top (no thermals): 33.53,42.93 35.56,42.93 35.56,40.13 36.45,39.24 36.45,35.05 34.92,35.05 34.92,36.32 33.91,37.34 33.91,39.62 33.53,40.01
BAT+
  pour Top (no thermals): 43.05,29.97 44.32,29.97 44.32,27.69 48.26,27.69 48.26,23.62 43.05,23.62
BEEP  (via drill 0.3 pad 0.71)
  Top 0.254: IC10.29 29.22,22.24 v30.99,24
  Bottom 0.254: v30.99,24 30.99,23.24 28.96,21.21 28.96,18.54 28.57,18.16 25.15,18.16 R32.1
BOOT0  (via drill 0.3 pad 0.71)
  Top 0.254: IC10.44 23.13,28.94 BOOT.1
  Bottom 0.254: R21.1 22.35,29.72 BOOT.1
  other vias: 22.61,29.46
BOOT1
  Top 0.254: IC10.20 24.63,14.36 25.65,13.34 27.43,13.34 R22.1
C1  (via drill 0.3 pad 0.71)
  Top 0.254: IC10.43 23.63,28.96 v24.13,29.46
  Bottom 0.203: IC3.2 22.1,33.91 23.11,32.89 23.11,30.73 24.13,29.72 v24.13,29.46
C1O  (via drill 0.3 pad 0.71)
  Top 1.27: MOTOR1.3 15.37,46.61 19.81,42.16 19.81,40.89
  Bottom 0.406: C3.2 20.83,42.55 IC3.6
  other vias: 20.83,41.02
  pour Top (no thermals): 19.3,42.93 21.34,42.93 21.34,40.26 22.23,39.37 22.23,35.05 20.7,35.05 20.7,36.07 19.68,37.08 19.68,39.88 19.3,40.26
C2  (via drill 0.3 pad 0.71)
  Top 0.203: IC10.38 26.13,28.03 26.92,28.83 v31.37,28.83
  Bottom 0.203: IC6.2 43.43,33.4 38.86,28.83 v31.37,28.83
C2O  (via drill 0.3 pad 0.71)
  Top 1.27: MOTOR2.3 41.15,45.59 41.15,41.02
  Bottom 0.406: C6.2 42.16,42.55 IC6.6
  other vias: 42.16,41.02
  pour Top (no thermals): 40.64,42.93 42.67,42.93 42.67,39.88 43.56,38.99 43.56,35.05 42.04,35.05 42.04,36.2 41.02,37.21 41.02,39.62 40.64,40.01
CLK  (via drill 0.3 pad 0.71)
  Top 0.254: v4.7,28.7 4.7,30.61 SWD.2 | IC10.37 26.63,26.37 26.29,26.04 25.78,26.04 v25.53,25.78
  Bottom 0.254: 4.7,28.83 v4.7,28.7 4.7,26.67 6.73,24.64 14.22,24.64 15.11,23.75 17.14,23.75 17.65,24.26 21.08,24.26 21.34,24.51 24.26,24.51 v25.53,25.78
D+  (via drill 0.3 pad 0.71)
  Top 0.254: IC10.33 29.19,24.24 v29.46,24.51 29.97,24.51 R15.2 | R14.1 v12.06,11.56
  Bottom 0.254: v29.46,24.51 26.92,21.97 26.16,21.97 25.65,22.48 22.35,22.48 22.1,22.23 21.21,22.23 20.57,21.59 20.57,19.56 19.68,18.67 13.46,18.67 11.56,16.76 11.56,13.46 11.3,13.21 11.3,12.32 v12.06,11.56
D-  (via drill 0.3 pad 0.71)
  Top 0.254: R13.1 v12.06,12.83 | IC10.32 29.22,23.74 v29.46,23.5
  Bottom 0.254: v12.06,12.83 12.06,16.51 13.72,18.16 19.94,18.16 21.08,19.3 21.08,21.34 21.46,21.72 22.35,21.72 22.61,21.97 25.4,21.97 25.91,21.46 27.43,21.46 v29.46,23.5
EN  (via drill 0.3 pad 0.71)
  Top 0.203: C43.1 8.64,31.88 11.05,31.88 v11.68,32.51 | v15.24,32.51 15.88,31.88 18.16,31.88 v18.8,32.51 | v22.35,32.51 22.99,31.88 25.27,31.88 v25.91,32.51 | v29.46,32.51 30.1,31.88 32.38,31.88 v33.02,32.51 | v36.58,32.51 v38.35,30.73
  Top 0.254: v11.3,21.84 11.3,24.77 ON.A 11.43,27.18 v11.43,28.45 | v19.3,19.43 19.3,20.24 IC10.12
  Bottom 0.203: IC1.3 6.6,33.91 C43.1 8.38,32.13 8.38,31.5 v11.43,28.45 | IC6.3 42.16,34.16 38.73,30.73 v38.35,30.73 | v11.68,32.51 13.72,34.54 | 13.72,34.54 IC2.3 | v15.24,32.51 15.24,33.02 13.72,34.54 | v18.8,32.51 20.83,34.54 | 20.83,34.54 IC3.3 | v22.35,32.51 22.35,33.02 20.83,34.54 | v25.91,32.51 27.94,34.54 | 27.94,34.54 IC4.3 | v29.46,32.51 29.46,33.02 27.94,34.54 | v33.02,32.51 35.05,34.54 | 35.05,34.54 IC5.3 | v36.58,32.51 36.58,33.02 35.05,34.54
  Bottom 0.254: v19.3,19.43 13.72,19.43 v11.3,21.84
  other vias: 8,32.51
GND  (via drill 0.3, 0.5, 0.6)
  other vias: 5.33,36.07 5.33,35.31 12.45,36.07 12.45,35.31 19.56,36.07 19.56,35.31 26.67,36.07 26.67,35.31 33.78,36.07 33.78,35.31 40.89,36.07 40.89,35.31 29.72,25.53 19.68,28.7 28.19,17.4 12.06,31.24 18.8,30.99 25.15,30.86 48.39,8.38 48.39,19.81 46.48,14.1 44.96,15.88 48.13,15.88 48.13,12.32 44.96,12.32 14.61,31.24 21.08,30.99 27.69,31.24 30.48,30.73 32.77,30.73 39.88,8.89 17.02,27.43 15.24,27.43 48.64,36.96 48.64,39.88 48.64,42.8 43.43,45.47 43.43,48.51 6.6,48.39 6.6,45.47 5.08,31.88 1.4,16.26 1.4,7.24 8.53,21.89 34.04,21.84 32.64,23.37 35.43,23.37 1.4,11.81 34.29,7.62
  pour Bottom (isolate 0.254, rank 6, no thermals): 0,0 0,50 50,50 50,0
  pour Top (isolate 0.254, rank 6, no thermals): 0,0 0,50 50,50 50,0
INT  (via drill 0.3 pad 0.71)
  Top 0.254: IC10.3 20.48,24.74 24.26,20.95 v24.26,20.7
  Bottom 0.254: v24.26,20.7 24.26,17.27 24.64,16.89 27.43,16.89 31.24,13.08 34.67,13.08 38.35,9.4 38.35,5.08 39.37,4.06 41.15,4.06 IMU.1
IO  (via drill 0.3 pad 0.71)
  Top 0.254: IC10.34 26.57,24.74 v26.54,24.77
  Bottom 0.254: v26.54,24.77 25.78,24 21.59,24 21.34,23.75 17.91,23.75 17.4,23.24 14.86,23.24 13.97,24.13 6.48,24.13 4.19,26.42 4.19,28.07 3.17,29.08 3.17,37.21 SWD.4
LEDA  (via drill 0.3 pad 0.71)
  Top 0.254: IC10.41 24.63,25.9 v24.51,25.78
  Bottom 0.254: v24.51,25.78 23.75,25.02 21.08,25.02 20.83,24.77 17.4,24.77 16.89,24.26 15.37,24.26 14.48,25.15 7.37,25.15 A.A
  other vias: 6.6,25.91
LEDB  (via drill 0.3 pad 0.71)
  Top 0.254: IC10.42 24.13,26.41 v23.5,25.78 | B.A 8.39,25.91 B.A
  Bottom 0.254: v23.5,25.78 23.24,25.53 20.83,25.53 20.57,25.27 17.14,25.27 16.64,24.77 15.62,24.77 14.73,25.65 8.64,25.65 B.A
  other vias: 8.38,25.91
MISO
  Top 0.254: IC10.27 29.7,21.24 29.92,21.46 33.15,21.46 35.05,19.56 IC11.2
MOSI
  Top 0.254: IC10.28 29.48,21.74 29.84,22.1 IC11.5
N$1  (via drill 0.3 pad 0.71)
  Top 0.203: R3.1 15.67,33.48 15.67,37.03 15.11,37.59 v15.11,39.5
  Bottom 0.203: IC2.7 14.99,39.62 v15.11,39.5
N$2
  Top 0.203: Q1.2 6.6,34.42 R2.2
N$3
  Top 0.203: Q1.4 9.14,34.42 R1.2
N$4  (via drill 0.3 pad 0.71)
  Top 0.203: R4.1 13.13,33.48 13.13,36.65 12.57,37.21 v12.57,39.5
  Bottom 0.203: IC2.5 12.45,39.62 v12.57,39.5
N$5
  Bottom 0.406: C2.1 16.26,42.55 IC2.8 16.26,40.51 17.53,40.51 D2.C
N$6
  Bottom 0.406: C1.1 9.14,42.55 IC1.8 9.14,40.51 10.41,40.51 D1.C
N$7
  Top 0.203: Q2.2 13.72,34.42 R4.2
N$8
  Top 0.203: Q2.4 16.26,34.42 R3.2
N$9  (via drill 0.3 pad 0.71)
  Top 0.203: R5.1 22.78,33.48 22.78,37.16 22.23,37.72 v22.23,39.5
  Bottom 0.203: IC3.7 22.1,39.62 v22.23,39.5
N$10  (via drill 0.3 pad 0.71)
  Top 0.203: R6.1 20.24,33.48 20.24,36.52 19.68,37.08 v19.68,39.5
  Bottom 0.203: IC3.5 19.56,39.62 v19.68,39.5
N$11
  Bottom 0.406: C3.1 23.37,42.55 IC3.8 23.37,40.51 24.64,40.51 D3.C
N$12
  Top 0.203: Q3.2 20.83,34.42 R6.2
N$13
  Top 0.203: Q3.4 23.37,34.42 R5.2
N$14  (via drill 0.3 pad 0.71)
  Top 0.203: R7.1 29.9,33.48 29.9,37.16 29.34,37.72 v29.34,39.5
  Bottom 0.203: IC4.7 29.21,39.62 v29.34,39.5
N$15  (via drill 0.3 pad 0.71)
  Top 0.203: R8.1 27.36,33.48 27.36,36.65 26.8,37.21 v26.8,39.5
  Bottom 0.203: IC4.5 26.67,39.62 v26.8,39.5
N$16
  Bottom 0.406: C4.1 30.48,42.55 IC4.8 30.48,40.51 31.75,40.51 D4.C
N$17
  Top 0.203: Q4.2 27.94,34.42 R8.2
N$18
  Top 0.203: Q4.4 30.48,34.42 R7.2
N$19  (via drill 0.3 pad 0.71)
  Top 0.203: R1.1 8.56,33.48 8.56,37.16 8,37.72 v8,39.5
  Bottom 0.203: IC1.7 7.87,39.62 v8,39.5
N$20  (via drill 0.3 pad 0.71)
  Top 0.203: R2.1 6.02,33.48 6.02,36.65 5.46,37.21 v5.46,39.5
  Bottom 0.203: IC1.5 5.33,39.62 v5.46,39.5
N$21  (via drill 0.3 pad 0.71)
  Top 0.203: R9.1 37.01,33.48 37.01,37.16 36.45,37.72 v36.45,39.5
  Bottom 0.203: IC5.7 36.32,39.62 v36.45,39.5
N$22  (via drill 0.3 pad 0.71)
  Top 0.203: R10.1 34.47,33.48 34.47,36.52 33.91,37.08 v33.91,39.5
  Bottom 0.203: IC5.5 33.78,39.62 v33.91,39.5
N$23
  Bottom 0.406: C5.1 37.59,42.55 37.59,41.66 IC5.8 37.59,40.51 38.86,40.51 D5.C
N$24
  Top 0.203: Q5.2 35.05,34.42 R10.2
N$25
  Top 0.203: Q5.4 37.59,34.42 R9.2
N$26  (via drill 0.3 pad 0.71)
  Top 0.203: R11.1 44.12,33.48 44.12,37.16 43.56,37.72 v43.56,39.5
  Bottom 0.203: IC6.7 43.43,39.62 v43.56,39.5
N$27  (via drill 0.3 pad 0.71)
  Top 0.203: R12.1 41.58,33.48 41.58,36.52 41.02,37.08 v41.02,39.5
  Bottom 0.203: IC6.5 40.89,39.62 v41.02,39.5
N$28
  Bottom 0.406: C6.1 44.7,42.55 IC6.8 44.7,40.51 45.97,40.51 D6.C
N$29
  Top 0.203: Q6.2 42.16,34.42 R12.2
N$30
  Top 0.203: Q6.4 44.7,34.42 R11.2
N$31
  Top 0.254: USB.2 9.05,12.61 R13.2
N$32
  Bottom 0.508: IC12.5 34.48,27.62 C29.1
N$33
  Top 0.254: USB.3 9.02,11.81 R14.2
N$34
  Top 0.508: C19.1 34.48,13.08 IC8.4
N$35
  Top 0.254: R25.2 22.61,9.53 IN1.1
N$36
  Top 0.508: C20.1 IC9.4
N$37
  Top 0.406: USB.1 8.33,13.41 8.89,13.97 9.14,13.97 L1.2
N$38
  Top 0.203: C21.1 X1.1 16.13,21.59 17.78,23.24 IC10.6
N$39
  Top 0.203: C38.1 X1.2 16.13,25.4 17.79,23.74 IC10.5
N$40
  Bottom 0.508: IC12.3 37.78,25.72 36.83,26.67 35.31,26.67 C29.2
N$41
  Top 0.406: R18.1 35.95,7.49 PWR.C
N$42
  Bottom 0.254: COM.1 2.16,19.56 R19.2
N$43
  Bottom 0.254: COM.2 4.45,22.1 R20.2
N$44
  Top 0.254: R26.2 24.26,8.64 IN2.1
N$45
  Top 0.254: R27.2 25.91,8.51 IN3.1
N$46
  Top 0.254: R28.2 27.56,9.4 IN4.1
N$49
  Bottom 0.254: T1.C 17.91,12.53 D9.C BUZZ.2
N$50
  Bottom 0.254: R32.2 R33.1 23.3,15.05 T1.B
N$51
  Top 0.254: R34.1 ON.C
N$55
  Top 0.254: R35.1 A.C
N$56
  Top 0.254: R36.1 B.C
NRST  (via drill 0.3 pad 0.71)
  Top 0.254: v3.94,29.46 3.94,25.15 9.14,19.94 16.64,19.94 17.27,20.57 17.27,21.97 18.04,22.74 IC10.7 21.2,22.74 v23.24,20.7
  Bottom 0.254: SWD.5 3.17,39.75 3.17,37.97 3.68,37.47 3.68,29.72 v3.94,29.46 | 23.24,19.3 C40.1 | R23.1 23.24,19.3 | 23.24,19.3 v23.24,20.7
NSS
  Top 0.254: IC11.1 35.43,18.29 33.53,20.19 30.1,20.19 R24.2 29.29,20.24 IC10.25
RC1
  Top 0.254: IC10.16 22.63,11.58 R25.1
RC2
  Top 0.254: IC10.17 23.13,12.69 R26.1
RC3
  Top 0.254: IC10.18 23.63,13.33 24.64,12.32 25.15,12.32 R27.1
RC4
  Top 0.254: IC10.19 24.13,13.85 25.15,12.83 26.29,12.83 R28.1
RX  (via drill 0.3 pad 0.71)
  Top 0.254: IC10.31 27.05,23.24 v26.54,23.75
  Bottom 0.254: v26.54,23.75 26.29,23.5 21.84,23.5 21.59,23.24 18.16,23.24 17.65,22.73 14.61,22.73 13.72,23.62 4.7,23.62 R19.1
SCK
  Top 0.254: IC10.26 31.28,20.74 IC11.6
SCL  (via drill 0.3 pad 0.71)
  Top 0.254: IC10.21 25.13,17.16 v27.18,15.11
  Bottom 0.254: v27.18,15.11 30.23,12.06 34.16,12.06 37.34,8.89 IMU.3
SDA  (via drill 0.3 pad 0.71)
  Top 0.254: IC10.22 25.63,17.68 v28.19,15.11
  Bottom 0.254: v28.19,15.11 30.73,12.57 34.42,12.57 37.85,9.14 37.85,4.83 IMU.2
TX  (via drill 0.3 pad 0.71)
  Top 0.254: IC10.30 v26.55,22.74 v26.54,22.73
  Bottom 0.254: v26.54,22.73 26.29,22.99 22.1,22.99 21.84,22.73 18.41,22.73 17.91,22.23 14.35,22.23 13.46,23.11 6.48,23.11 6.1,22.73 6.1,22.23 R20.1
VBAT  (via drill 0.3 pad 0.71)
  Top 0.254: R16.2 R17.1 C39.1 33.27,25.91 v32.13,24.77 | IC10.11 21.63,20.74 v21.84,20.95
  Bottom 0.254: v32.13,24.77 30.61,24.77 30.23,24.38 30.23,23.24 27.94,20.95 25.65,20.95 25.15,21.46 22.86,21.46 22.35,20.95 v21.84,20.95
VBUS
  Top 0.406: L1.1 C41.1 10.79,16.26 9.7,17.35 D7.2
VCC  (via drill 0.5)
  Top 0.61: C16.1 38.99,16.22 IC7.1
  Top 1.016: IC7.1 40.26,16.38 41.4,17.53 41.4,19.15 C15.+
  Top 1.27: C15.+ 42.06,19.79 41.53,20.32 41.53,21.46 40.26,22.73 40.26,27.3
  Bottom 0.406: C12.1 C11.+ | C13.1 C14.+
  Bottom 1.27: C11.+ C14.+ | v46.74,38.1 v45.85,38.1 v44.58,38.1 v39.62,38.1 v38.73,38.1 v37.47,38.1 v32.51,38.1 v31.62,38.1 v30.35,38.1 v25.4,38.1 v24.51,38.1 v23.24,38.1 v18.29,38.1 v17.4,38.1 v16.13,38.1 v11.18,38.1 v10.29,38.1 v9.02,38.1
  pour Top (rank 2, no thermals): 7.62,42.93 11.56,42.93 11.56,36.7 9.14,36.7 8.13,37.72 8.13,39.5 7.62,40.01
  pour Top (rank 2, no thermals): 14.73,42.93 18.67,42.93 18.67,36.7 16.13,36.7 15.37,37.47 15.37,39.62 14.73,40.13
  pour Top (rank 2, no thermals): 36.07,42.93 40.01,42.93 40.01,32.13 40.77,31.37 40.77,26.92 37.72,26.92 37.72,28.19 36.58,28.19 36.58,28.7 37.72,28.7 37.72,36.7 37.08,36.7 37.08,37.34 36.58,37.85 36.58,39.62 36.07,40.13
  pour Top (rank 2, no thermals): 43.18,42.93 47.12,42.93 47.12,36.7 44.7,36.7 43.69,37.72 43.69,39.75 43.18,40.26
  pour Top (rank 2, no thermals): 28.96,42.93 32.89,42.93 32.89,36.7 30.48,36.7 29.59,37.85 29.59,39.37 28.96,40.01
  pour Top (rank 2, no thermals): 21.84,46.61 28.45,46.61 28.45,45.34 25.78,45.34 25.78,36.7 23.5,36.7 22.48,37.72 22.48,39.62 21.84,40.26
VDRV
  Bottom 0.406: C36.1 IC5.1 37.59,36.96 | C35.1 IC4.1 30.48,36.96 | C34.1 IC3.1 23.37,36.96 | C33.1 IC2.1 16.26,36.96 | C32.1 IC1.1 9.14,36.58 9.53,36.96 10.79,36.96 | 17.91,36.96 16.26,36.96 | 16.26,36.96 10.79,36.96 | 10.79,36.96 D1.A | 25.02,36.96 23.37,36.96 | 23.37,36.96 17.91,36.96 | 17.91,36.96 D2.A | D6.A 46.35,36.96 44.7,36.96 | 44.7,36.96 39.24,36.96 | 44.7,36.96 IC6.1 C37.1 44.7,32.89 40.89,29.08 40.89,28.19 41.02,28.07 | D5.A 39.24,36.96 | 39.24,36.96 37.59,36.96 | 37.59,36.96 32.13,36.96 | D4.A 32.13,36.96 | 32.13,36.96 30.48,36.96 | 30.48,36.96 25.02,36.96 | 25.02,36.96 D3.A
  Bottom 0.508: IC12.1 40.32,27.62 C31.1 40.77,28.07 41.02,28.07 D8.C
VREG  (via drill 0.3 pad 0.71)
  Top 0.406: 13.52,13.27 C24.1 | v13.46,14.86 C26.1 | 34.35,9.21 C23.1 | 32.45,9.33 v32.64,9.14
  Top 0.508: IC9.1 13.52,15.17 C26.1 11.94,16.13 11.94,17.65 D7.3 | IC9.3 13.52,13.27 | IC8.3 34.35,9.21 | IC8.1 32.45,9.33 | C23.1 35.81,9.14 PWR.A
  Bottom 0.508: C24.1 v13.46,14.86 15.24,16.64 18.54,16.64 21.08,14.1 22.35,14.1 26.29,10.16 31.62,10.16 v32.64,9.14 | v32.64,9.14 C23.1 | IMU.5 32.64,3.17 v32.64,9.14
  other vias: 13.46,13.34 34.29,9.14
  pour Top (no thermals): 32.13,9.4 34.54,9.4 34.54,8.89 32.13,8.89
  pour Top (no thermals): 13.21,15.24 13.72,15.24 13.72,13.21 13.21,13.21

### Text on the board
tPlace: VauDUO | NRST | v1.2 | designed by / SVentas (2013) | IO | GND | CLK | +5V | GND | +5V | TX | RX | SIG | +5V | +3V3 | +5V | GND | SCL | SDA | INT
bPlace: MOTOR-1 | MOTOR-2 | SWD | POWER | VauDUO v1.2 | designed by / SVentas (2013) | SIG | SIG | +3V3 | BUZZ | +5V | A D C | RECEIVER | GND | I M U